# EasyEDA Pro project ProPrj_arm_can_tool_2026-04-18.epro, schematic Schematic1, sheets 1 to 2 of 3

## Sheets
1 P1: Board Name: Board1; Create Date: 2026-01-16; Page Name: P1; Project Name: arm_can_tool; Schematic Name: Schematic1; Update Date: 2026-04-10; Company: CC0 PUBLIC DOMAIN; Drawed: koendv; Page Size: A3; Part Number: JLCPCB-002; Version: 1.0
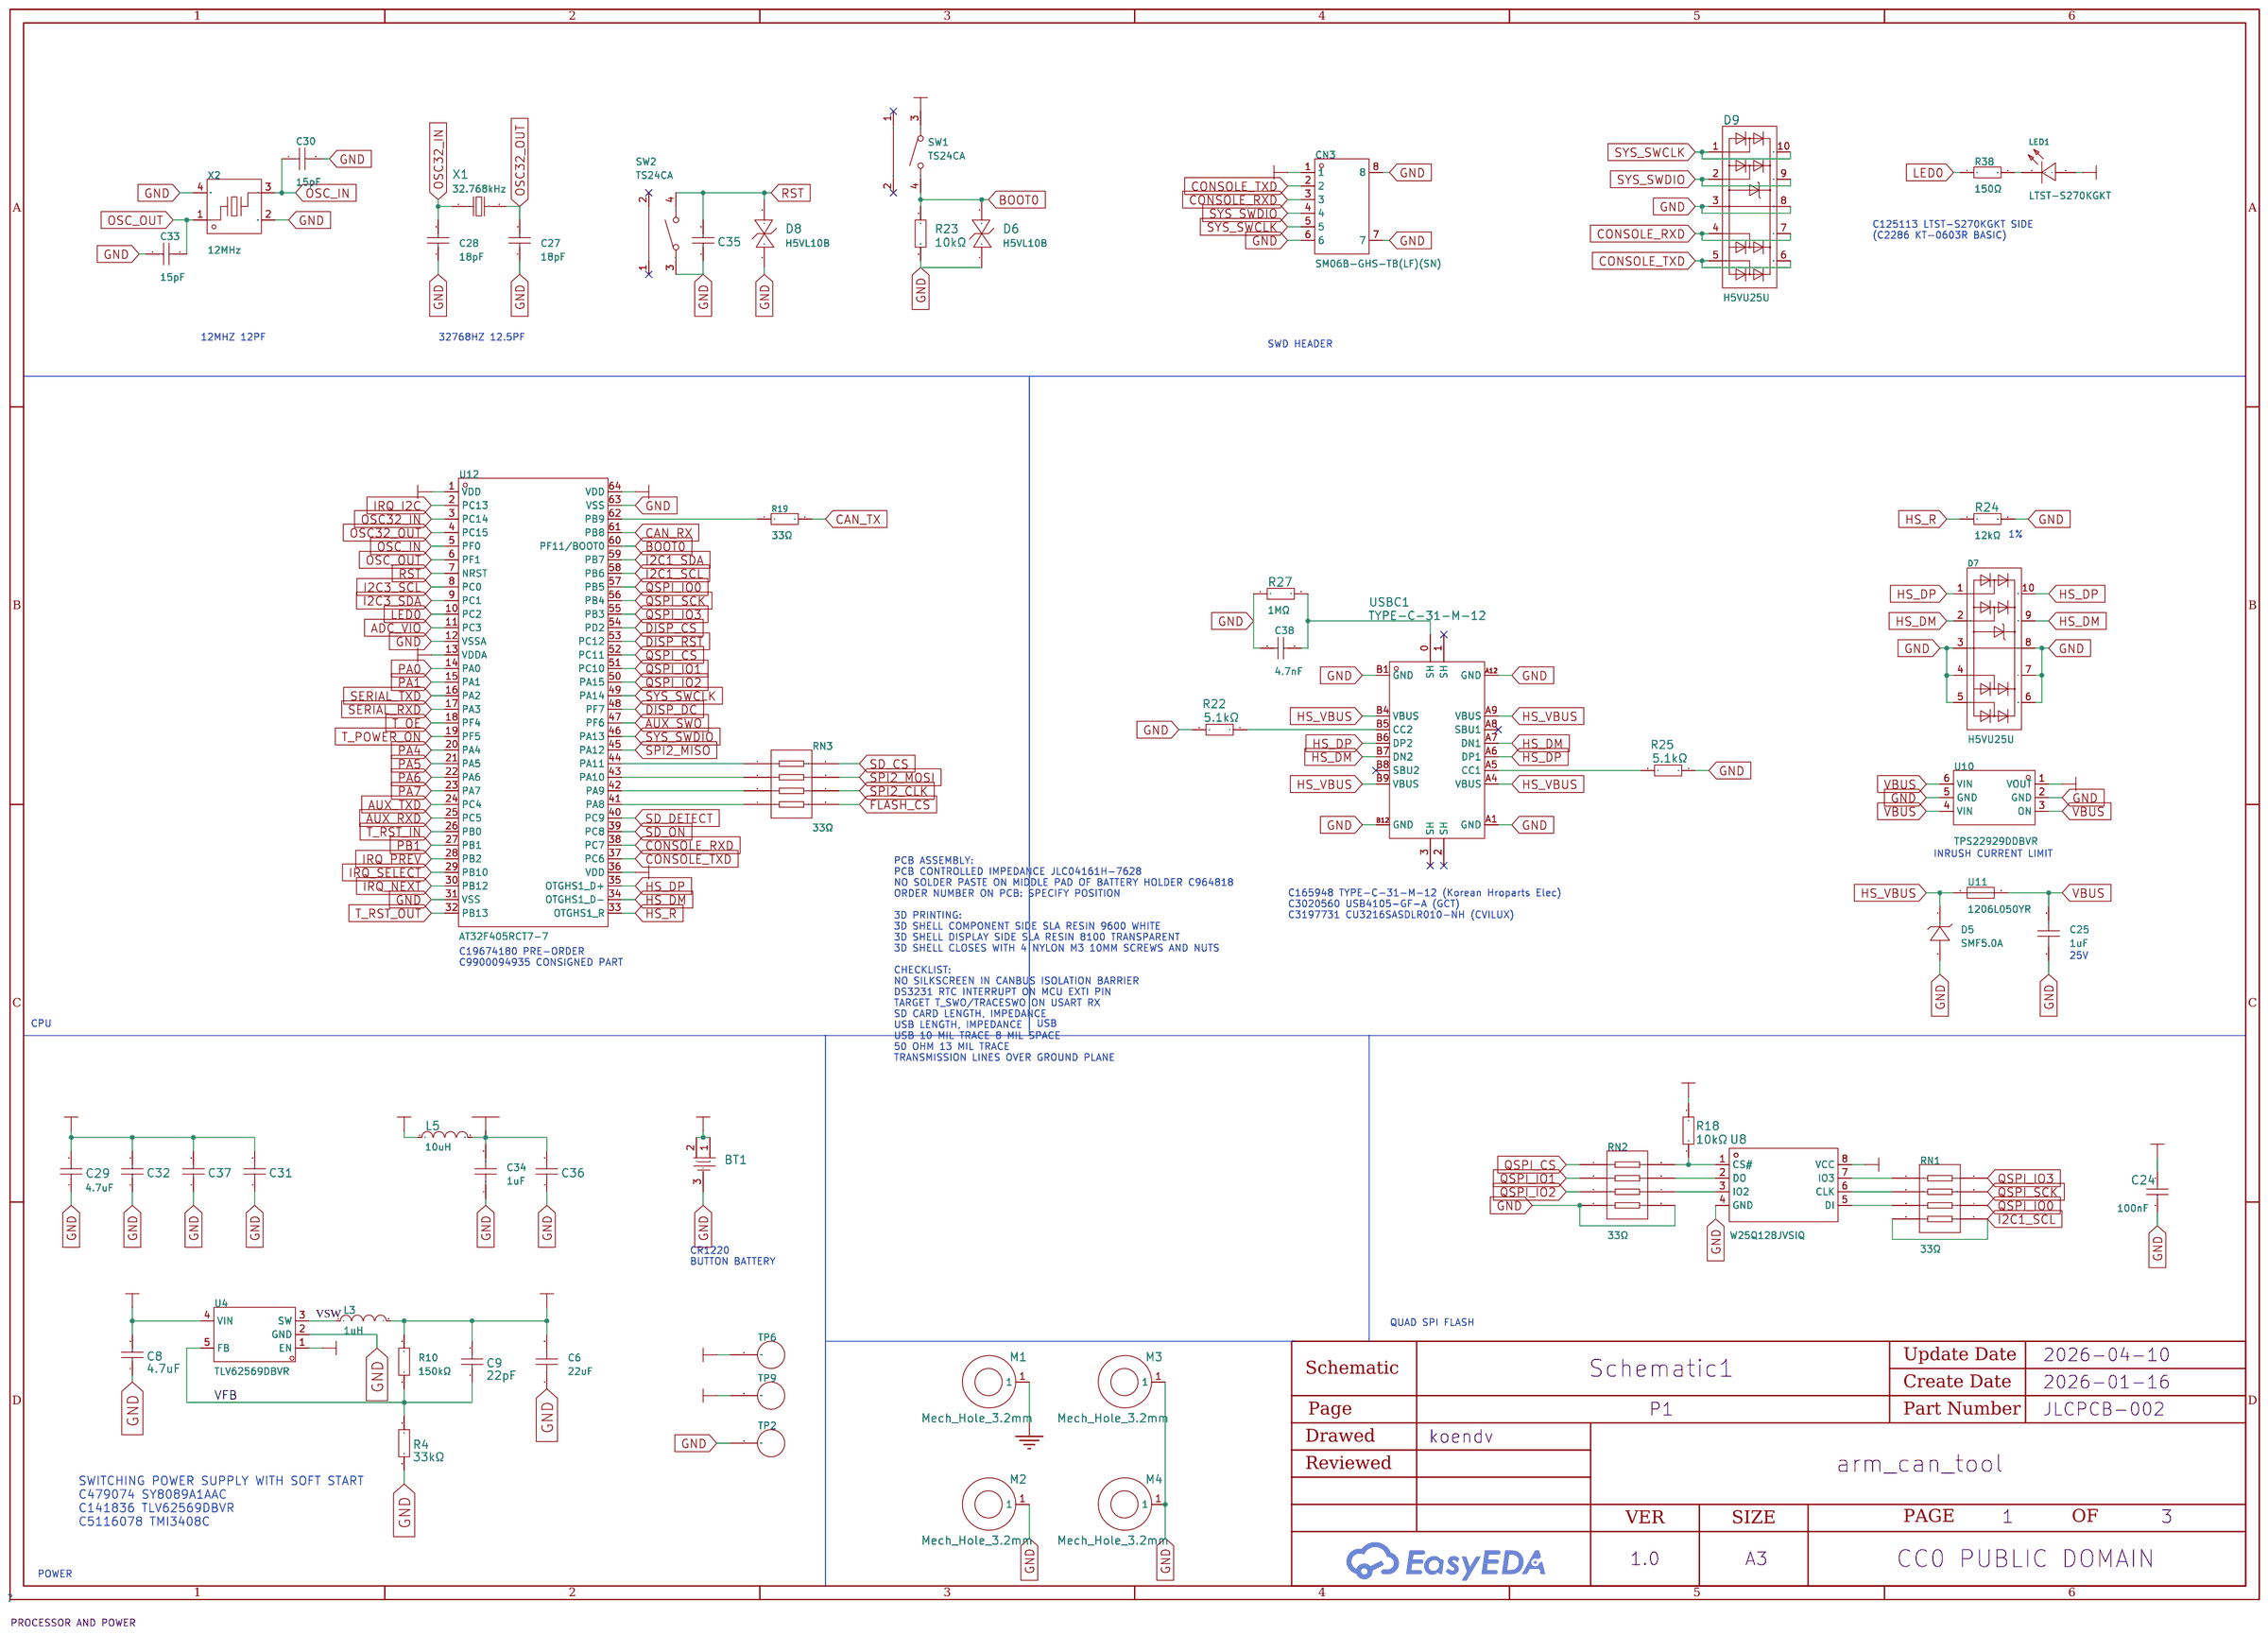
[diagram p0: P1]
2 P2: Page Name: P2; Update Date: 2026-04-11
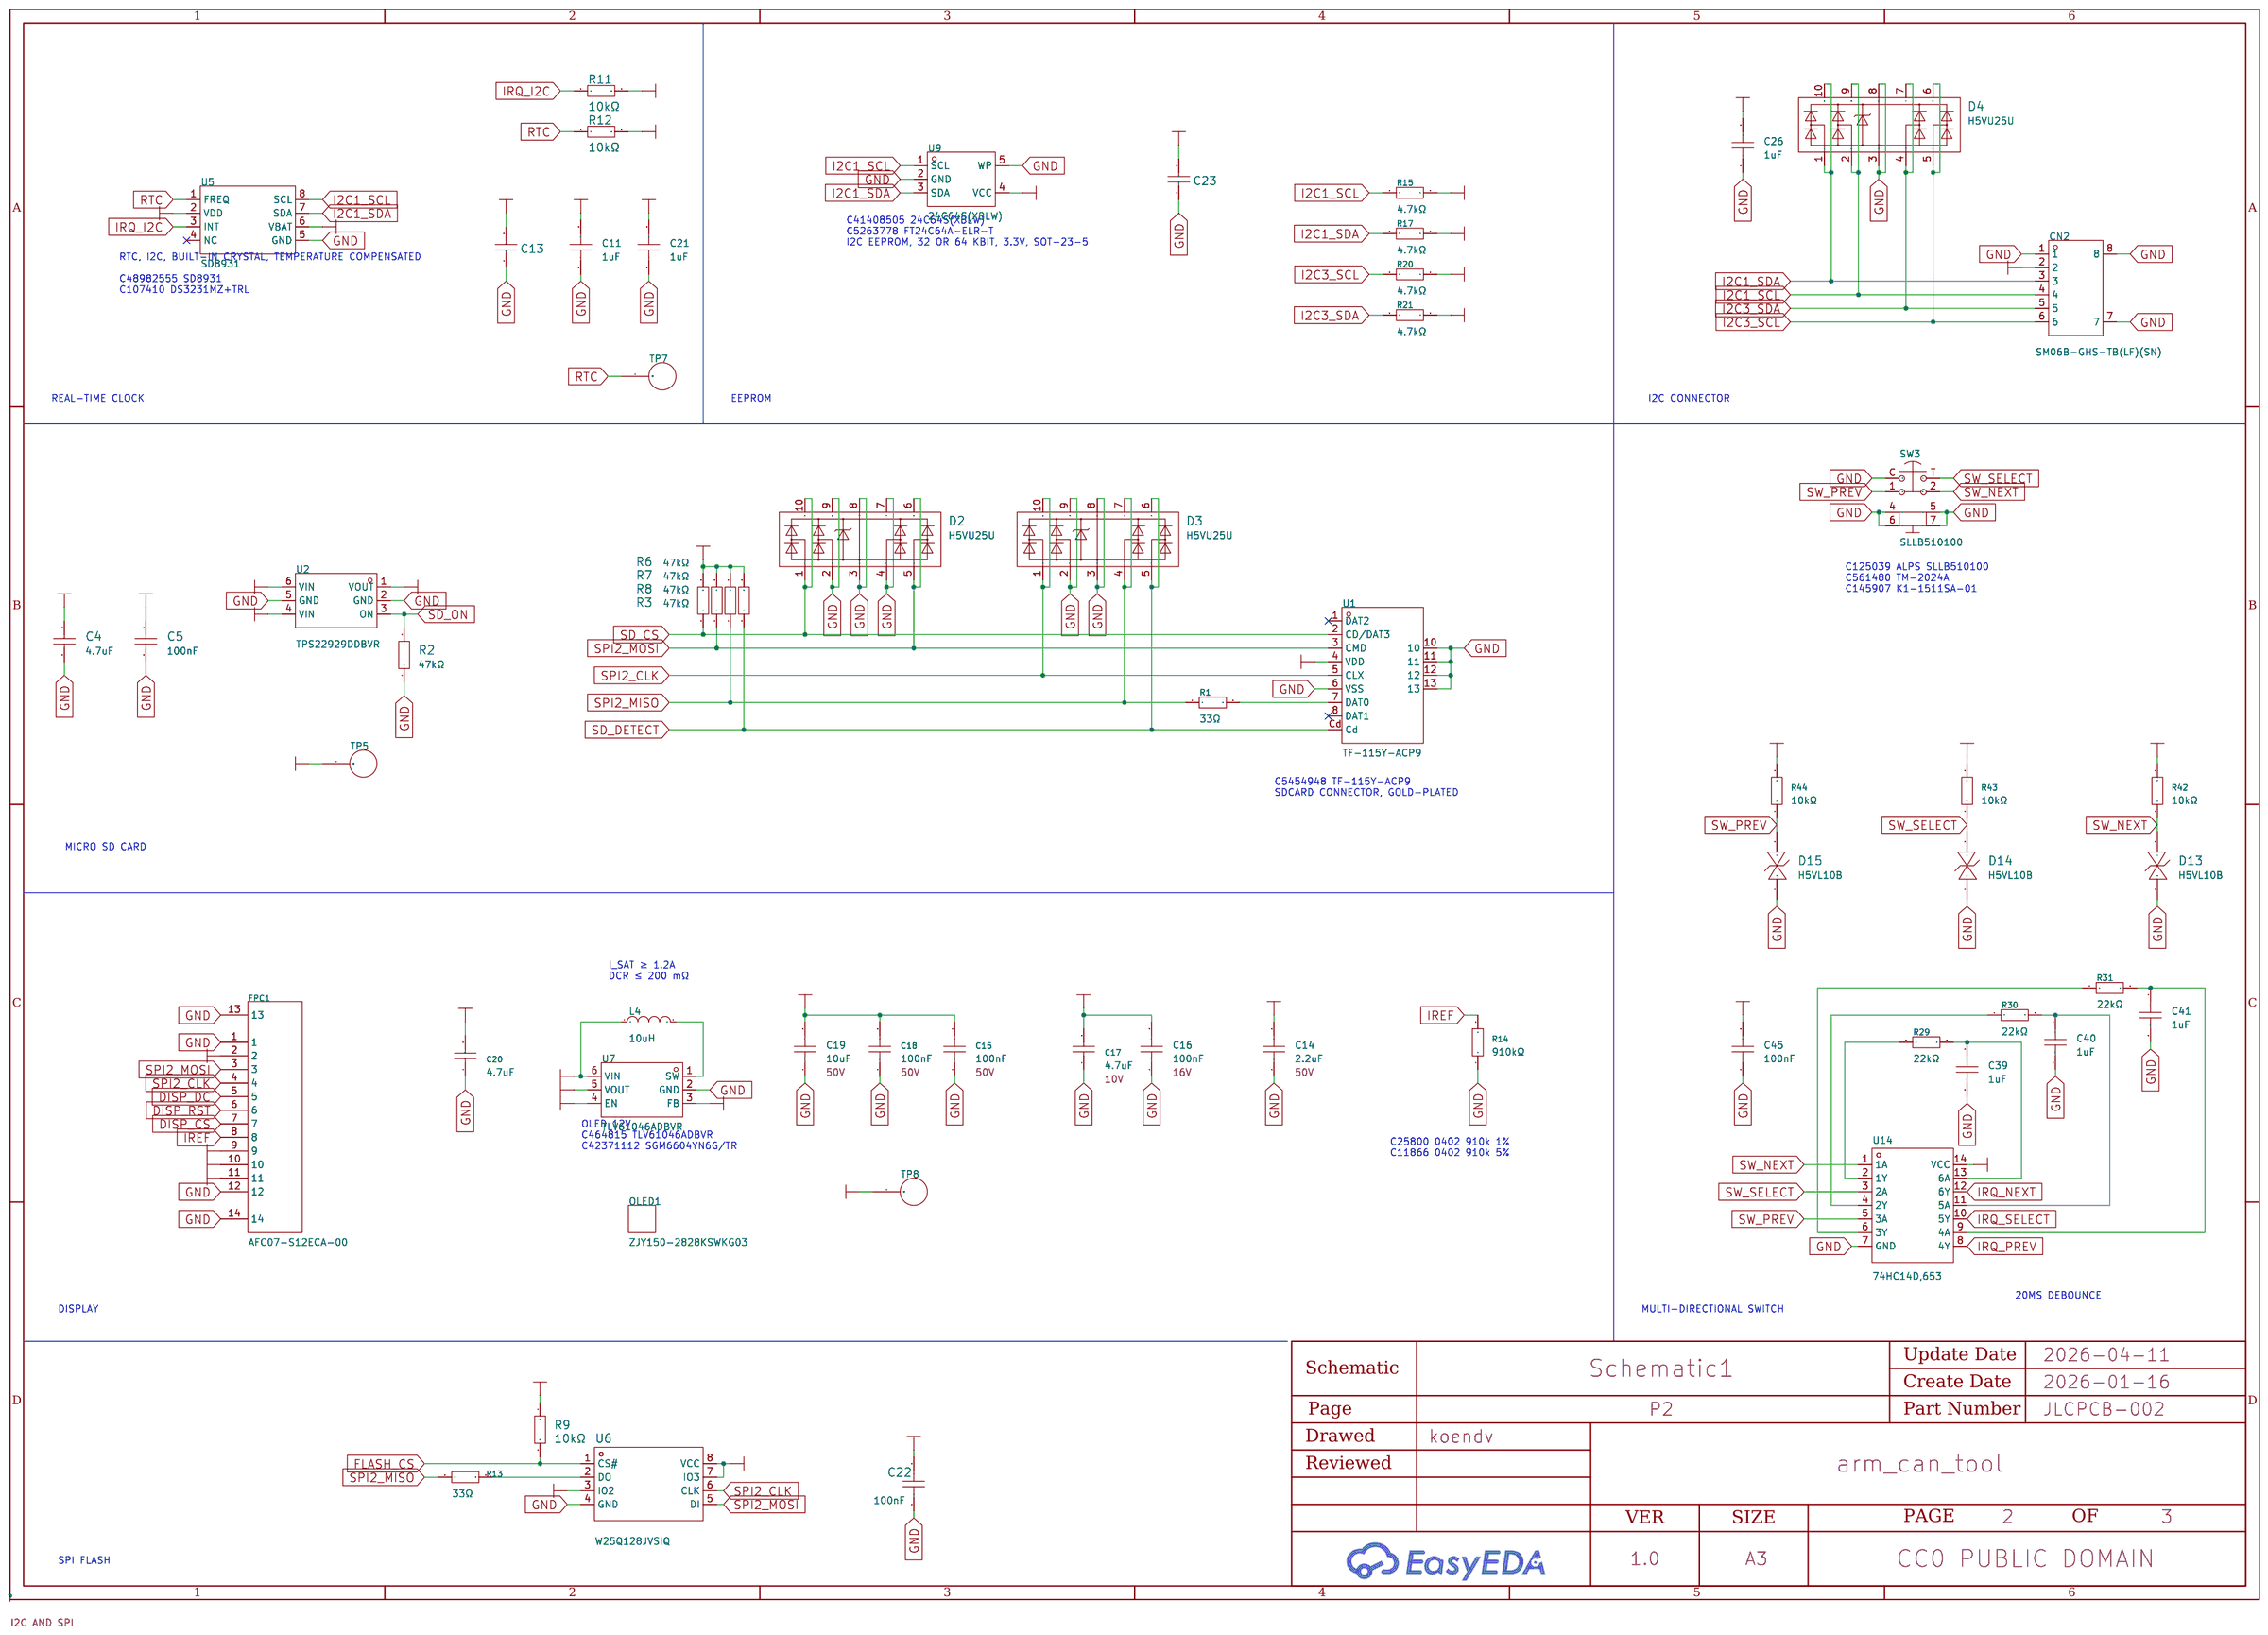
[diagram p1: P2]

## Parts
sheet P1
BT1  MY-1220-03  [BAT-SMD_MY-1220-03]
C6  22uF  [C0603]
C8  4.7uF  [C0603]
C9  22pF  [C0402]
C24  100nF  [C0402]
C25  1uF  [C0402]
C27  18pF  [C0402]
C28  18pF  [C0402]
C29  4.7uF  [C0402]
C30  15pF  [C0402]
C31  100nF  [C0402]
C32  100nF  [C0402]
C33  15pF  [C0402]
C34  1uF  [C0402]
C35  100nF  [C0402]
C36  100nF  [C0402]
C37  100nF  [C0402]
C38  4.7nF  [C0402]
CN3  SM06B-GHS-TB(LF)(SN)  [CONN-TH_SM06B-GHS-TB-LF-SN]
D5  SMF5.0A  [SOD-123FL_L2.7-W1.8-LS3.8-RD]
D6  H5VL10B  [SOD-882_L1.0-W0.6-BI]
D7  H5VU25U  [DFN2510-10_L2.5-W1.0-P0.50-BL]
D8  H5VL10B  [SOD-882_L1.0-W0.6-BI]
D9  H5VU25U  [DFN2510-10_L2.5-W1.0-P0.50-BL]
L3  1uH  [IND-SMD_L2.5-W2.0-A]
L5  10uH  [L0603]
LED1  LTST-S270KGKT  [LED-SMD_L1.7-W0.6-RD]
M1  Mech_Hole_3.2mm  [MECH_HOLE_3.2MM]  (no BOM)
M2  Mech_Hole_3.2mm  [MECH_HOLE_3.2MM]  (no BOM)
M3  Mech_Hole_3.2mm  [MECH_HOLE_3.2MM]  (no BOM)
M4  Mech_Hole_3.2mm  [MECH_HOLE_3.2MM]  (no BOM)
R4  33kΩ  [R0402]
R10  150kΩ  [R0402]
R18  10kΩ  [R0402]
R19  33Ω  [R0402]
R22  5.1kΩ  [R0402]
R23  10kΩ  [R0402]
R24  12kΩ  [R0402]
R25  5.1kΩ  [R0402]
R27  1MΩ  [R0402]
R38  150Ω  [R0402]
RN1  33Ω  [RES-ARRAY-SMD_0402-8P-L2.0-W1.0-BL]
RN2  33Ω  [RES-ARRAY-SMD_0402-8P-L2.0-W1.0-BL]
RN3  33Ω  [RES-ARRAY-SMD_0402-8P-L2.0-W1.0-BL]
SW1  TS24CA  [SW-SMD_TS24CA]
SW2  TS24CA  [SW-SMD_TS24CA]
TP2  -  [TEST PAD]  (no BOM)
TP6  -  [TEST PAD]  (no BOM)
TP9  -  [TEST PAD]  (no BOM)
U4  TLV62569DBVR  [SOT-23-5_L3.0-W1.7-P0.95-LS2.8-BR]
U8  W25Q128JVSIQ  [SOIC-8_L5.3-W5.3-P1.27-LS8.0-BL]
U10  TPS22929DDBVR  [SOT-23-6_L2.9-W1.6-P0.95-LS2.8-BL]
U11  1206L050YR  [F1206]
U12  AT32F405RCT7-7  [LQFP-64_L7.0-W7.0-P0.40-LS9.0-TL]
USBC1  TYPE-C-31-M-12  [USB-C_SMD-TYPE-C-31-M-12]
X1  32.768kHz  [FC-135R_L3.2-W1.5]
X2  12MHz  [CRYSTAL-SMD_4P-L3.2-W2.5-BL]
sheet P2
C4  4.7uF  [C0603]
C5  100nF  [C0402]
C11  1uF  [C0402]
C13  100nF  [C0402]
C14  2.2uF  [C0805]
C15  100nF  [C0603]
C16  100nF  [C0402]
C17  4.7uF  [C0402]
C18  100nF  [C0603]
C19  10uF  [C0805]
C20  4.7uF  [C0402]
C21  1uF  [C0402]
C22  100nF  [C0402]
C23  100nF  [C0402]
C26  1uF  [C0402]
C39  1uF  [C0402]
C40  1uF  [C0402]
C41  1uF  [C0402]
C45  100nF  [C0402]
CN2  SM06B-GHS-TB(LF)(SN)  [CONN-TH_SM06B-GHS-TB-LF-SN]
D2  H5VU25U  [DFN2510-10_L2.5-W1.0-P0.50-BL]
D3  H5VU25U  [DFN2510-10_L2.5-W1.0-P0.50-BL]
D4  H5VU25U  [DFN2510-10_L2.5-W1.0-P0.50-BL]
D13  H5VL10B  [SOD-882_L1.0-W0.6-BI]
D14  H5VL10B  [SOD-882_L1.0-W0.6-BI]
D15  H5VL10B  [SOD-882_L1.0-W0.6-BI]
FPC1  AFC07-S12ECA-00  [FPC-SMD_12P-P0.50_AFC07-S12ECA-00]
L4  10uH  [IND-SMD_L4.1-W4.1_FTC404020S]
OLED1  ZJY150-2828KSWKG03  [OLED-ZJY150-2828KSWKG03]
R1  33Ω  [R0402]
R2  47kΩ  [R0402]
R3  47kΩ  [R0402]
R6  47kΩ  [R0402]
R7  47kΩ  [R0402]
R8  47kΩ  [R0402]
R9  10kΩ  [R0402]
R11  10kΩ  [R0402]
R12  10kΩ  [R0402]
R13  33Ω  [R0402]
R14  910kΩ  [R0402]
R15  4.7kΩ  [R0402]
R17  4.7kΩ  [R0402]
R20  4.7kΩ  [R0402]
R21  4.7kΩ  [R0402]
R29  22kΩ  [R0402]
R30  22kΩ  [R0402]
R31  22kΩ  [R0402]
R42  10kΩ  [R0402]
R43  10kΩ  [R0402]
R44  10kΩ  [R0402]
SW3  SLLB510100  [SW-SMD_SLLB510100]
TP5  -  [TEST PAD]  (no BOM)
TP7  -  [TEST PAD]  (no BOM)
TP8  -  [TEST PAD]  (no BOM)
U1  TF-115Y-ACP9  [SIM-SMD_TF-115Y-BCP9]
U2  TPS22929DDBVR  [SOT-23-6_L2.9-W1.6-P0.95-LS2.8-BL]
U5  SD8931  [SOP-8_L4.9-W3.9-P1.27-LS6.0-BL-1]
U6  W25Q128JVSIQ  [SOIC-8_L5.3-W5.3-P1.27-LS8.0-BL]
U7  TLV61046ADBVR  [SOT-23-6_L2.9-W1.6-P0.95-LS2.8-BL]
U9  24C64S(XBLW)  [SOT-23-5_L2.9-W1.6-P0.95-LS2.8-BR]
U14  74HC14D,653  [SOIC-14_L8.7-W3.9-P1.27-LS6.0-BL]

## Library data of the parts
BT1 = MY-1220-03: Connector Type:Battery button Battery Type:CR1220 Operating Temperature Range:-25℃~+85℃ Operating Temperature Range:-25℃~+85℃; Supplier Part: C964818; Manufacturer: MYOUNG(美阳); Supplier Footprint: SMD; JLCPCB Part Class: Extended Part; Datasheet: https://atta.szlcsc.com/upload/public/pdf/source/20201218/C964818_B03812FB908E34364C1125E65C8EBE5C.pdf; Supplier: LCSC; Connector Type: Battery button; Battery Type: CR1220; Operating Temperature Range: -25℃~+85℃; Check: false
C6 = CL10A226MQ8NRNC: Capacitance: Tolerance:±20% Tolerance:±20% Voltage Rated: Temperature Coefficient:; LCSC Part Name: 22uF ±20% 6.3V; Supplier Part: C59461; Manufacturer: SAMSUNG(三星); Supplier Footprint: 0603; JLCPCB Part Class: Basic Part; Datasheet: https://atta.szlcsc.com/upload/public/pdf/source/20160218/1457707763339.pdf; Supplier: LCSC; Tolerance: ±20%; Check: false
C4 C8 = CL10A475KO8NNNC: Capacitance:4.7uF Tolerance:±10% Tolerance:±10% Voltage Rating:16V Temperature Coefficient:X5R; LCSC Part Name: 4.7uF ±10% 16V; Supplier Part: C19666; Manufacturer: SAMSUNG(三星); Supplier Footprint: 0603; JLCPCB Part Class: Basic Part; Datasheet: https://item.szlcsc.com/datasheet/CL10A475KO8NNNC/20375.html; Supplier: LCSC; Tolerance: ±10%; Temperature Coefficient: X5R; Voltage Rating: 16V; Check: false
C9 = 0402CG220J500NT: Supplier: LCSC; Manufacturer: FH(风华); Supplier Part: C1555; JLCPCB Part Class: Basic Part; Check: false; LCSC Part Name: 50V 22pF C0G ±5%
C5 C24 C45 = CL05B104KO5NNNC: Capacitance: Tolerance:±10% Tolerance:±10% Voltage Rated: Temperature Coefficient:; LCSC Part Name: 100nF ±10% 16V; Supplier Part: C1525; Manufacturer: SAMSUNG(三星); Supplier Footprint: 0402; JLCPCB Part Class: Basic Part; Datasheet: https://atta.szlcsc.com/upload/public/pdf/source/20160218/1457707763339.pdf; Supplier: LCSC; Tolerance: ±10%; Check: false
C11 C21 C25 C26 C34 C39-C41 = CL05A105KA5NQNC: Capacitance: Tolerance:±10% Tolerance:±10% Voltage Rated: Temperature Coefficient:; LCSC Part Name: 1uF ±10% 25V; Supplier Part: C52923; Manufacturer: SAMSUNG(三星); Supplier Footprint: 0402; JLCPCB Part Class: Basic Part; Datasheet: https://atta.szlcsc.com/upload/public/pdf/source/20160218/1457707763339.pdf; Supplier: LCSC; Tolerance: ±10%; Check: false
C27 C28 = 0402CG180J500NT: Capacitance: Tolerance:±5% Tolerance:±5% Voltage Rated: Temperature Coefficient:; LCSC Part Name: 18pF ±5% 50V; Supplier Part: C1549; Manufacturer: FH(风华); Supplier Footprint: 0402; JLCPCB Part Class: Basic Part; Datasheet: https://atta.szlcsc.com/upload/public/pdf/source/20200305/C486355_26A10D38EF8C2A5C37091D0039909270.pdf; Supplier: LCSC; Tolerance: ±5%; Check: false
C20 C29 = CL05A475MP5NRNC: Capacitance: Tolerance:±20% Tolerance:±20% Voltage Rated: Temperature Coefficient:; LCSC Part Name: 4.7uF ±20% 10V; Supplier Part: C23733; Manufacturer: SAMSUNG(三星); Supplier Footprint: 0402; JLCPCB Part Class: Basic Part; Datasheet: https://atta.szlcsc.com/upload/public/pdf/source/20160218/1457707763339.pdf; Supplier: LCSC; Tolerance: ±20%; Check: false
C30 C33 = 0402CG150J500NT: Capacitance: Tolerance:±5% Tolerance:±5% Voltage Rated: Temperature Coefficient:; LCSC Part Name: 15pF ±5% 50V; Supplier Part: C1548; Manufacturer: FH(风华); Supplier Footprint: 0402; JLCPCB Part Class: Basic Part; Datasheet: https://atta.szlcsc.com/upload/public/pdf/source/20200305/C486355_26A10D38EF8C2A5C37091D0039909270.pdf; Supplier: LCSC; Tolerance: ±5%; Check: false
C31 C32 C35-C37 = CL05B104KO5NNNC: Capacitance: Tolerance:±10% Tolerance:±10% Voltage Rated: Temperature Coefficient:; LCSC Part Name: 100nF ±10% 16V; Supplier Part: C1525; Manufacturer: SAMSUNG(三星); Supplier Footprint: 0402; JLCPCB Part Class: Basic Part; Datasheet: https://atta.szlcsc.com/upload/public/pdf/source/20160218/1457707763339.pdf; Supplier: LCSC; Tolerance: ±10%; 3DModel: C0402_L1.0-W0.5-H0.5; link: https://item.szlcsc.com/15869.html; Check: false
C38 = 0402B472K500NT: Capacitance:4.7nF Tolerance:±10% Tolerance:±10% Voltage Rated: Temperature Coefficient:; LCSC Part Name: 4.7nF ±10% 50V; Supplier Part: C1538; Manufacturer: FH(风华); Supplier Footprint: 0402; JLCPCB Part Class: Basic Part; Datasheet: https://atta.szlcsc.com/upload/public/pdf/source/20200305/C486355_26A10D38EF8C2A5C37091D0039909270.pdf; Supplier: LCSC; Tolerance: ±10%; Check: false
CN2 CN3 = SM06B-GHS-TB(LF)(SN): Pins Structure:1x6P Pitch:1.25mm Mounting Style:Horizontal attachment Reference Series:GH Number of Pins:6P Number of Rows:1 Number of PINs Per Row:6 Row Spacing:- Current Rating (Max):1A Contact Material:Phosphor Bronze Contact Plating:Tin Operating Temp; LCSC Part Name: 1x6P 间距:1.25mm 卧贴 系列:GH; Supplier Part: C133065; Manufacturer: JST; Supplier Footprint: SMD,P=1.25mm,卧贴; JLCPCB Part Class: Extended Part; Datasheet: https://atta.szlcsc.com/upload/public/pdf/source/20180323/112205B2CF875947C9562BFC7B01FA26.pdf; Supplier: LCSC; Pins Structure: 1x6P; Pitch: 1.25mm; Mounting Style: Horizontal attachment; Reference Series: GH; Number of Pins: 6P; Number of Rows: 1; Number of PINs Per Row: 6; Current Rating (Max): 1A; Contact Material: Phosphor Bronze; Contact Plating: Tin; Operating Temperature Range: -25℃~+85℃; Rated Voltage (Max): 50V; Plastic Material: PA9T; Flame Retardant Rating: UL94V-0; Supplementary Features: Auxiliary soldering legs; Colour: White; Z-Height of the Board: 4.25mm; X-Length of Bottom Edge on Board (Spacing Line): 10.75mm; Y-Width of Bottom Edge on Board: 4.13mm; Check: false
D5 = SMF5.0A_C19077497: Polarity:Unidirectional Reverse Stand-Off Voltage (Vrwm):5V Clamping Voltage:9.2V Peak Pulse Current (Ipp):21.7A@10/1000us Peak Pulse Power Dissipation (Ppp):200W@10/1000us Voltage - Breakdown:7V Reverse Leakage Current (Ir):400uA Number of Channels:1 Ope; LCSC Part Name: 单向TVS 5V截止 峰值浪涌电流：21.7A@10/1000us; Supplier Part: C19077497; Manufacturer: R+O(宏嘉诚); Supplier Footprint: SOD-123FL; JLCPCB Part Class: Extended Part; Datasheet: https://item.szlcsc.com/datasheet/SMF5.0A/20275582.html; Supplier: LCSC; Polarity: Unidirectional; Reverse Stand-Off Voltage (Vrwm): 5V; Clamping Voltage: 9.2V; Peak Pulse Current (Ipp): 21.7A@10/1000us; Peak Pulse Power Dissipation (Ppp): 200W@10/1000us; Voltage - Breakdown: 7V; Reverse Leakage Current (Ir): 400uA; Number of Channels: 1; Operating Temperature: -55℃~+150℃; level of protection: IEC 61000-4-2; Type: TVS; Check: false
D6 D8 D13-D15 = H5VL10B: polarity:Bi-Directional Reverse Stand-Off Voltage (Vrwm):5V Maximum Clamping Voltage:10V Peak Pulse Current (Ipp)@10/1000us:5A Peak Pulse Power Dissipation (Ppp)@10/1000us:50W Breakdown Voltage:5.6V Reverse Leakage Current (Ir):100nA Number of Lines:单路 Op; Supplier Part: C7420372; Manufacturer: 宏迦橙; Supplier Footprint: DFN1006-2L; JLCPCB Part Class: Extended Part; Datasheet: https://atta.szlcsc.com/upload/public/pdf/source/20230630/5024ECFEAD3C9801B07A8DBB967AB462.pdf; Supplier: LCSC; polarity: Bi-Directional; Reverse Stand-Off Voltage (Vrwm): 5V; Maximum Clamping Voltage: 10V; Peak Pulse Current (Ipp)@10/1000us: 5A; Peak Pulse Power Dissipation (Ppp)@10/1000us: 50W; Breakdown Voltage: 5.6V; Reverse Leakage Current (Ir): 100nA; Number of Lines: 单路; Operating Temperature: -55℃~+155℃; Type: TVS; Check: false
D2-D4 D7 D9 = H5VU25U: polarity:Unidirectional Reverse Stand-Off Voltage (Vrwm):5V Maximum Clamping Voltage:14V Peak Pulse Current (Ipp)@10/1000us:4A Peak Pulse Power Dissipation (Ppp)@10/1000us:56W Breakdown Voltage:6V Reverse Leakage Current (Ir):1uA Number of Lines:Quad Oper; Supplier Part: C7420374; Manufacturer: 宏迦橙; Supplier Footprint: DFN2510-10L; JLCPCB Part Class: Extended Part; Datasheet: https://atta.szlcsc.com/upload/public/pdf/source/20230630/91FD1DB17AB88B6832D3039FAE61FF10.pdf; Supplier: LCSC; polarity: Unidirectional; Reverse Stand-Off Voltage (Vrwm): 5V; Maximum Clamping Voltage: 14V; Peak Pulse Current (Ipp)@10/1000us: 4A; Peak Pulse Power Dissipation (Ppp)@10/1000us: 56W; Breakdown Voltage: 6V; Reverse Leakage Current (Ir): 1uA; Number of Lines: Quad; Operating Temperature: -55℃~+155℃; Type: TVS; Check: false
L3 = TFM252012ALM-1R0MTAA: Inductance: Tolerance:±20% Tolerance:±20% Rated Current:- DC Resistance (DCR):-; LCSC Part Name: 1uH ±20%; Supplier Part: C433057; Manufacturer: TDK; Supplier Footprint: SMD; JLCPCB Part Class: Extended Part; Supplier: LCSC; Tolerance: ±20%; Check: false
L5 = SDFL1608S100KTF: Inductance: Tolerance: Tolerance: Rated Current: Saturation Current (Isat):- DC Resistance (DCR): Q @ Freq:30@2MHz Frequency - Self Resonant: Ratings:; LCSC Part Name: 10uH ±10% 3mA 1.85Ω; Supplier Part: C1035; Manufacturer: Sunlord(顺络); Supplier Footprint: 0603; JLCPCB Part Class: Basic Part; Supplier: LCSC; Q @ Freq: 30@2MHz; Check: false
LED1 = LTST-S270KGKT: Emitted Color:Green-yellow Power Dissipation:75mW Forward Current:20mA Dominant Wavelength:571nm Dominant Wavelength:571nm Peak Wavelength:574nm Diode Configuration:- Lens Color:无色透明透镜 Color Temperature:- Color Temperature:- Viewing Angle:130° Mounting Sy; LCSC Part Name: 普绿/黄绿 侧贴; Supplier Part: C125113; Manufacturer: LITEON(光宝); Supplier Footprint: SMD,1.2x1.6mm; JLCPCB Part Class: Extended Part; Datasheet: https://atta.szlcsc.com/upload/public/pdf/source/20180104/C125113_15150602232371230485.pdf; Supplier: LCSC; Emitted Color: Green-yellow; Power Dissipation: 75mW; Forward Current: 20mA; Dominant Wavelength: 571nm; Peak Wavelength: 574nm; Lens Color: 无色透明透镜; Viewing Angle: 130°; Mounting Sytle: Side stickers; Operating Temperature: -30℃~+85℃; Check: false
M1-M4 = Mech_Hole_3.2mm: Check: false; Height: 0.001mm
R4 = 0402WGF3302TCE: Supplier: LCSC; Manufacturer: UNI-ROYAL(厚声); Supplier Part: C25779; Resistance: 33K; JLCPCB Part Class: Basic Part; Check: false; LCSC Part Name: 33kΩ ±1% 62.5mW 厚膜电阻
R10 = 0402WGF1503TCE: Type:Thick Film Resistors Resistance:150kΩ Tolerance:±1% Tolerance:±1% Power(Watts): Overload Voltage (Max): Temperature Coefficient:±100ppm/℃ Temperature Coefficient:±100ppm/℃ Operating Temperature Range:-55℃~+155℃ Operating Temperature Range:-55℃~+155℃; LCSC Part Name: 150kΩ ±1% 62.5mW 厚膜电阻; Supplier Part: C25755; Manufacturer: UNI-ROYAL(厚声); Supplier Footprint: 0402; JLCPCB Part Class: Extended Part; Datasheet: https://atta.szlcsc.com/upload/public/pdf/source/20200306/C422600_1E6D84923E4A46A82E41ADD87F860B5C.pdf; Supplier: LCSC; Type: Thick Film Resistors; Tolerance: ±1%; Temperature Coefficient: ±100ppm/℃; Operating Temperature Range: -55℃~+155℃; Check: false
R9 R11 R12 R18 R23 = 0402WGF1002TCE: Type:Thick Film Resistor Resistance:10kΩ Tolerance:±1% Tolerance:±1% Power(Watts):62.5mW Voltage-Supply(Max):50V Temperature Coefficient:±100ppm/℃ Temperature Coefficient:±100ppm/℃ Operating Temperature:-55℃~+155℃ Operating Temperature:-55℃~+155℃; LCSC Part Name: 10kΩ ±1% 62.5mW 厚膜电阻; Supplier Part: C25744; Manufacturer: UNI-ROYAL(厚声); Supplier Footprint: 0402; JLCPCB Part Class: Basic Part; Datasheet: https://atta.szlcsc.com/upload/public/pdf/source/20200306/C422600_1E6D84923E4A46A82E41ADD87F860B5C.pdf; Supplier: LCSC; Tolerance: ±1%; Power(Watts): 62.5mW; Temperature Coefficient: ±100ppm/℃; Type: Thick Film Resistors; Operating Temperature Range: -55℃~+155℃; Voltage-Supply(Max): 50V; Operating Temperature: -55℃~+155℃; Check: false
R1 R13 R19 = 0402WGF330JTCE: Type:Thick Film Resistors Resistance:33Ω Tolerance:±1% Tolerance:±1% Power(Watts): Overload Voltage (Max): Temperature Coefficient:±100ppm/℃ Temperature Coefficient:±100ppm/℃ Operating Temperature Range:-55℃~+155℃ Operating Temperature Range:-55℃~+155℃; LCSC Part Name: 33Ω ±1% 62.5mW 厚膜电阻; Supplier Part: C25105; Manufacturer: UNI-ROYAL(厚声); Supplier Footprint: 0402; JLCPCB Part Class: Basic Part; Datasheet: https://atta.szlcsc.com/upload/public/pdf/source/20200306/C422600_1E6D84923E4A46A82E41ADD87F860B5C.pdf; Supplier: LCSC; Type: Thick Film Resistors; Tolerance: ±1%; Temperature Coefficient: ±100ppm/℃; Operating Temperature Range: -55℃~+155℃; Check: false
R22 R25 = 5.1kΩ: link: https://item.szlcsc.com/323315.html; 3DModel: R0402_L1.0-W0.5-H0.5; Supplier: LCSC; Manufacturer: UNI-ROYAL(厚声); Manufacturer Part: 0402WGF5101TCE; Supplier Part: C25905; Resistance: 5.1K; JLCPCB Part Class: BasicPart; Check: false
R24 = 0402WGF1202TCE: Type:Thick Film Resistors Resistance:12kΩ Tolerance:±1% Tolerance:±1% Power(Watts): Overload Voltage (Max): Temperature Coefficient:±100ppm/℃ Temperature Coefficient:±100ppm/℃ Operating Temperature Range:-55℃~+155℃ Operating Temperature Range:-55℃~+155℃; LCSC Part Name: 12kΩ ±1% 62.5mW 厚膜电阻; Supplier Part: C25752; Manufacturer: UNI-ROYAL(厚声); Supplier Footprint: 0402; JLCPCB Part Class: Basic Part; Datasheet: https://atta.szlcsc.com/upload/public/pdf/source/20200306/C422600_1E6D84923E4A46A82E41ADD87F860B5C.pdf; Supplier: LCSC; Type: Thick Film Resistors; Tolerance: ±1%; Temperature Coefficient: ±100ppm/℃; Operating Temperature Range: -55℃~+155℃; Check: false
R27 = 0402WGF1004TCE: Resistance:1000000Ω Tolerance:±1% Tolerance:±1% Power(Watts): Overload Voltage (Max): Temperature Coefficient:±100ppm/℃ Temperature Coefficient:±100ppm/℃ Type:Thick Film Resistors Operating Temperature Range:-55℃~+155℃ Operating Temperature Range:-55℃~+15; LCSC Part Name: 1MΩ ±1% 62.5mW 厚膜电阻; Supplier Part: C26083; Manufacturer: UNI-ROYAL(厚声); Supplier Footprint: 0402; JLCPCB Part Class: Basic Part; Datasheet: https://atta.szlcsc.com/upload/public/pdf/source/20200306/C422600_1E6D84923E4A46A82E41ADD87F860B5C.pdf; Supplier: LCSC; Tolerance: ±1%; Temperature Coefficient: ±100ppm/℃; Type: Thick Film Resistors; Operating Temperature Range: -55℃~+155℃; Check: false
R38 = 0402WGF1500TCE: Type:Thick Film Resistors Resistance: Tolerance:±1% Tolerance:±1% Power(Watts): Overload Voltage (Max): Temperature Coefficient:±100ppm/℃ Temperature Coefficient:±100ppm/℃ Operating Temperature Range:-55℃~+155℃ Operating Temperature Range:-55℃~+155℃; LCSC Part Name: 150Ω ±1% 62.5mW 厚膜电阻; Supplier Part: C25082; Manufacturer: UNI-ROYAL(厚声); Supplier Footprint: 0402; JLCPCB Part Class: Extended Part; Datasheet: https://atta.szlcsc.com/upload/public/pdf/source/20200306/C422600_1E6D84923E4A46A82E41ADD87F860B5C.pdf; Supplier: LCSC; Type: Thick Film Resistors; Tolerance: ±1%; Temperature Coefficient: ±100ppm/℃; Operating Temperature Range: -55℃~+155℃; Check: false
RN1-RN3 = YC124-FR-0733RL: Number of Resistors: Resistance: Tolerance:±1% Tolerance:±1% Power(Watts): Temperature Coefficient:±200ppm/℃ Temperature Coefficient:±200ppm/℃ Number of Pins:; LCSC Part Name: 33Ω ±1% 0402x4; Supplier Part: C136851; Manufacturer: YAGEO(国巨); Supplier Footprint: 0402x4; JLCPCB Part Class: Extended Part; Datasheet: https://atta.szlcsc.com/upload/public/pdf/source/20180730/C256814_200CCA6CC84D78D7E49AE6680727F338.pdf; Supplier: LCSC; Tolerance: ±1%; Temperature Coefficient: ±200ppm/℃; Check: false
SW1 SW2 = TS24CA: Circuit:SPST Actuator Style:Rectangle button Mounting Style:卧贴 Switch Length:4.55mm Switch Width:1.8mm Switch Height:3.5mm Contact Current:50mA Voltage Rating (DC):12V With Lamp:- Mechanical Life:-; LCSC Part Name: 4.55*1.8*3.5mm 卧贴 轻触开关; Supplier Part: C393942; Manufacturer: SHOU HAN(首韩); Supplier Footprint: SMD; JLCPCB Part Class: Extended Part; Datasheet: https://atta.szlcsc.com/upload/public/pdf/source/20190521/C393942_591A9E318887EFA4274D34029981AD99.pdf; Supplier: LCSC; Circuit: SPST; Actuator Style: Rectangle button; Mounting Style: 卧贴; Switch Length: 4.55mm; Switch Width: 1.8mm; Switch Height: 3.5mm; Contact Current: 50mA; Voltage Rating (DC): 12V; Check: false
TP2 TP5-TP9 = TEST PAD: Check: false
U4 = TLV62569DBVR: Function:Step-down type Synchronous Rectification:Yes Output Type:Adjustable Number of Outputs:- Topology:Step-down Input Voltage:2.5V~5.5V Input Voltage:2.5V~5.5V Output Voltage:0.6V~5.5V Output Voltage:0.6V~5.5V Output Current (Max):2A Switching Frequen; LCSC Part Name: 降压型 输入2.5V~5.5V 输出600mV~5.5V 2A; Supplier Part: C141836; Manufacturer: TI(德州仪器); Supplier Footprint: SOT-23-5; JLCPCB Part Class: Extended Part; Datasheet: https://atta.szlcsc.com/upload/public/pdf/source/20180423/C141836_1FC17A3D2C2E4ECD339DF92B83CED618.pdf; Supplier: LCSC; Function: Step-down type; Synchronous Rectification: Yes; Output Type: Adjustable; Topology: Step-down; Input Voltage: 2.5V~5.5V; Output Voltage: 0.6V~5.5V; Output Current (Max): 2A; Switching Frequency: 1.5MHz; Operating Temperature: -40℃~+125℃@(TJ); Check: false
U8 = W25Q128JVSIQ: Interface Type:- Memory Size:128Mbit Clock Frequency (fc):- Supply Voltage:- Supply Voltage:- Supply Current (Read):- Supply Current (Program):- Supply Current (Erase):- Standby supply current:- Page Programming Time (Tpp):- Block Erase Time (tBE):- Data; LCSC Part Name: W25Q128JVSIQ 编带; Supplier Part: C97521; Manufacturer: WINBOND(华邦); Supplier Footprint: SOP-8-208mil; JLCPCB Part Class: Basic Part; Datasheet: https://atta.szlcsc.com/upload/public/pdf/source/20170316/1489627409956.pdf; Supplier: LCSC; Memory Size: 128Mbit; Check: false
U2 U10 = TPS22929DDBVR: Number of Outputs:1 Output Current:1.8A Input Voltage:1.4V~5.5V Input Voltage:1.4V~5.5V Resistor On-State:115mΩ Operating Temperature-:-40℃~+85℃ Operating Temperature-:-40℃~+85℃; Supplier Part: C415177; Manufacturer: TI(德州仪器); Supplier Footprint: SOT-23-6; JLCPCB Part Class: Extended Part; Datasheet: https://www.ti.com/cn/lit/gpn/tps22929d; Supplier: LCSC; Number of Outputs: 1; Output Current: 1.8A; Input Voltage: 1.4V~5.5V; Resistor On-State: 115mΩ; Operating Temperature	-: -40℃~+85℃; Check: false
U11 = 1206L050YR: Voltage - Max:6V Current - Max:100A Hold Current:500mA Trip Current:1A Power Dissipation:600mW Resistance - Initial (Ri) (Min):150mΩ Resistance - Post Trip (R1) (Max):700mΩ Time to Trip(Max):100ms Operating Temperature:-40℃~+85℃ Operating Temperature:-40℃; LCSC Part Name: 6V 500mA 1206自恢复; Supplier Part: C163512; Manufacturer: Littelfuse(美国力特); Supplier Footprint: 1206; JLCPCB Part Class: Extended Part; Datasheet: https://item.szlcsc.com/datasheet/1206L050YR/174894.html; Supplier: LCSC; Voltage - Max: 6V; Current - Max: 100A; Hold Current: 500mA; Trip Current: 1A; Power Dissipation: 600mW; Resistance - Initial (Ri) (Min): 150mΩ; Resistance - Post Trip (R1) (Max): 700mΩ; Time to Trip(Max): 100ms; Operating Temperature: -40℃~+85℃; Check: false
U12 = AT32F405RCT7-7: Supplier Part: C9900094935; Manufacturer: Artery(雅特力); Supplier Footprint: LQFP-64_7X7mm; JLCPCB Part Class: Extended Part; Supplier: LCSC; Check: false; Height: 1.4mm
USBC1 = TYPE-C-31-M-12: link: https://so.szlcsc.com/global.html?c=&amp;k=C165948; Supplier: LCSC; Supplier Part: C165948; Manufacturer: 韩国韩荣; JLCPCB Part Class: ExtendedPart; Check: false
X1 = Q13FC1350000400: Crystal Type:SMD Crystal Resonator Frequency: Load Capacitance: Equivalent Series Resistance (ESR):70kΩ Frequency Tolerance:±20ppm Frequency Tolerance:±20ppm Operating Temperature: Operating Temperature:; LCSC Part Name: 32.768kHz ±20ppm 12.5pF; Supplier Part: C32346; Manufacturer: EPSON(爱普生); Supplier Footprint: SMD3215-2P; JLCPCB Part Class: Basic Part; Datasheet: https://atta.szlcsc.com/upload/public/pdf/source/20190108/C32346_746D6B07EAF90824457A96480007685F.pdf; Supplier: LCSC; Crystal Type: SMD Crystal Resonator; Equivalent Series Resistance (ESR): 70kΩ; Frequency Tolerance: ±20ppm; Check: false
X2 = CJ13-120001210B20: Frequency:12MHz Normal temperature Frequency Tolerance:±10ppm Normal temperature Frequency Tolerance:±10ppm External load capacitor:; LCSC Part Name: 12MHz ±10ppm 12pF; Supplier Part: C2875246; Manufacturer: CJ(江苏长电/长晶); Supplier Footprint: SMD3225-4P; JLCPCB Part Class: Extended Part; Datasheet: https://atta.szlcsc.com/upload/public/pdf/source/20210824/E6873A29EC9F0F4D38BC5C84A85B05C9.pdf; Supplier: LCSC; Normal temperature Frequency Tolerance: ±10ppm; Check: false
C13 C22 C23 = CL05B104KO5NNNC: Capacitance: Tolerance:±10% Tolerance:±10% Voltage Rated: Temperature Coefficient:; LCSC Part Name: 100nF ±10% 16V; Supplier Part: C1525; Manufacturer: SAMSUNG(三星); Supplier Footprint: 0402; JLCPCB Part Class: Basic Part; Datasheet: https://atta.szlcsc.com/upload/public/pdf/source/20160218/1457707763339.pdf; Supplier: LCSC; Tolerance: ±10%; Check: false; Standardization Check: false
C14 = CL21A225KBQNNNE: Capacitance: Tolerance:±10% Tolerance:±10% Voltage Rated: Temperature Coefficient:; LCSC Part Name: 2.2uF ±10% 50V; Supplier Part: C377773; Manufacturer: SAMSUNG(三星); Supplier Footprint: 0805; JLCPCB Part Class: Basic Part; Datasheet: https://atta.szlcsc.com/upload/public/pdf/source/20160218/1457707763339.pdf; Supplier: LCSC; Tolerance: ±10%; Voltage Rated: 50V; Check: false
C15 C18 = CC0603KRX7R9BB104: Capacitance: Tolerance:±10% Tolerance:±10% Voltage Rated: Temperature Coefficient:; LCSC Part Name: 100nF ±10% 50V; Supplier Part: C14663; Manufacturer: YAGEO(国巨); Supplier Footprint: 0603; JLCPCB Part Class: Basic Part; Datasheet: https://atta.szlcsc.com/upload/public/pdf/source/20180910/C282072_33301C7F631E79921B82A8DAC6BCC5B3.pdf; Supplier: LCSC; Tolerance: ±10%; Voltage Rated: 50V; Check: false
C16 = CL05B104KO5NNNC: Capacitance: Tolerance:±10% Tolerance:±10% Voltage Rated: Temperature Coefficient:; LCSC Part Name: 100nF ±10% 16V; Supplier Part: C1525; Manufacturer: SAMSUNG(三星); Supplier Footprint: 0402; JLCPCB Part Class: Basic Part; Datasheet: https://atta.szlcsc.com/upload/public/pdf/source/20160218/1457707763339.pdf; Supplier: LCSC; Tolerance: ±10%; Voltage Rated: 16V; Check: false
C17 = CL05A475MP5NRNC: Capacitance: Tolerance:±20% Tolerance:±20% Voltage Rated: Temperature Coefficient:; LCSC Part Name: 4.7uF ±20% 10V; Supplier Part: C23733; Manufacturer: SAMSUNG(三星); Supplier Footprint: 0402; JLCPCB Part Class: Basic Part; Datasheet: https://atta.szlcsc.com/upload/public/pdf/source/20160218/1457707763339.pdf; Supplier: LCSC; Tolerance: ±20%; Voltage Rated: 10V; Check: false
C19 = GRM21BR61H106KE43L: Capacitance: Tolerance:±10% Tolerance:±10% Voltage Rated: Temperature Coefficient:; LCSC Part Name: 10uF ±10% 50V; Supplier Part: C440198; Manufacturer: muRata(村田); Supplier Footprint: 0805; JLCPCB Part Class: Basic Part; Datasheet: https://atta.szlcsc.com/upload/public/pdf/source/20230811/95AAE0C9AF55EDC31B7A4D8B733F534E.pdf; Supplier: LCSC; Tolerance: ±10%; Voltage Rated: 50V; Check: false
FPC1 = AFC07-S12ECA-00: Locking Feature:抽屉式 Contact Type:Contact,Top Number of Contacts:12P Pitch:0.5mm Mounting Type:卧贴 FFC, FCB Thickness:0.3mm FFC, FCB Thickness:0.3mm Height Above Board:2mm; LCSC Part Name: 间距:0.5mm P数:12P 抽屉式 上接; Supplier Part: C262585; Manufacturer: JS(钜硕电子); Supplier Footprint: SMD,P=0.5mm,卧贴; JLCPCB Part Class: Extended Part; Datasheet: https://atta.szlcsc.com/upload/public/pdf/source/20190726/C11082_A2E7B12387019CE4314BB5199EE0FDF4.pdf; Supplier: LCSC; Locking Feature: 抽屉式; Contact Type: Contact,Top; Number of Contacts: 12P; Pitch: 0.5mm; Mounting Type: 卧贴; FFC, FCB Thickness: 0.3mm; Height Above Board: 2mm; Check: false
L4 = FTC404020S100MGCA: Inductance:10uH Tolerance:±20% Tolerance:±20% Current Rating:3.4A Current - Saturation(Isat):4.9A DC Resistance(DCR):135mΩ Type:-; LCSC Part Name: 10uH ±20% 3.4A; Supplier Part: C39676074; Manufacturer: cjiang(长江微电); Supplier Footprint: SMD,4.1x4.1mm; JLCPCB Part Class: Extended Part; Datasheet: https://item.szlcsc.com/datasheet/FTC404020S100MGCA/41398075.html; Supplier: LCSC; Tolerance: ±20%; Current Rating: 3.4A; Current - Saturation(Isat): 4.9A; DC Resistance(DCR): 135mΩ; Check: false
OLED1 = OLED-ZJY150-2828KSWKG03: OLED 1.5 INCH 128*128 DOTS SH1107 CONTROLLER 插接式; Check: false; Manufacturer: Zhengzhou Zhongjingyuan(中景园); Supplier: taobao; Supplier Part: https://item.taobao.com/item.htm?id=756962244579; Product Link: https://www.alibaba.com/product-detail/1-5-inch-OLED-display-module_1601054555841.html
R2 R3 R6-R8 = 0402WGF4702TCE: Resistance:47000Ω Tolerance:±1% Tolerance:±1% Power(Watts): Overload Voltage (Max): Temperature Coefficient:±100ppm/℃ Temperature Coefficient:±100ppm/℃ Type:Thick Film Resistors Operating Temperature Range:-55℃~+155℃ Operating Temperature Range:-55℃~+155℃; LCSC Part Name: 47kΩ ±1% 62.5mW 厚膜电阻; Supplier Part: C25792; Manufacturer: UNI-ROYAL(厚声); Supplier Footprint: 0402; JLCPCB Part Class: Basic Part; Datasheet: https://atta.szlcsc.com/upload/public/pdf/source/20200306/C422600_1E6D84923E4A46A82E41ADD87F860B5C.pdf; Supplier: LCSC; Tolerance: ±1%; Temperature Coefficient: ±100ppm/℃; Type: Thick Film Resistors; Operating Temperature Range: -55℃~+155℃; Check: false
R14 = 0402WGF9103TCE: Type:Thick Film Resistors Resistance:910kΩ Tolerance:±1% Tolerance:±1% Power(Watts): Overload Voltage (Max): Temperature Coefficient:±100ppm/℃ Temperature Coefficient:±100ppm/℃ Operating Temperature Range:-55℃~+155℃ Operating Temperature Range:-55℃~+155℃; LCSC Part Name: 910kΩ ±1% 62.5mW 厚膜电阻; Supplier Part: C25800; Manufacturer: UNI-ROYAL(厚声); Supplier Footprint: 0402; JLCPCB Part Class: Extended Part; Datasheet: https://atta.szlcsc.com/upload/public/pdf/source/20200306/C422600_1E6D84923E4A46A82E41ADD87F860B5C.pdf; Supplier: LCSC; Type: Thick Film Resistors; Tolerance: ±1%; Temperature Coefficient: ±100ppm/℃; Operating Temperature Range: -55℃~+155℃; Check: false
R15 R17 R20 R21 = 0402WGF4701TCE: Resistance:4700Ω Tolerance:±1% Tolerance:±1% Power(Watts): Overload Voltage (Max): Temperature Coefficient:±100ppm/℃ Temperature Coefficient:±100ppm/℃ Type:Thick Film Resistors Operating Temperature Range:-55℃~+155℃ Operating Temperature Range:-55℃~+155℃; LCSC Part Name: 4.7kΩ ±1% 62.5mW 厚膜电阻; Supplier Part: C25900; Manufacturer: UNI-ROYAL(厚声); Supplier Footprint: 0402; JLCPCB Part Class: Basic Part; Datasheet: https://atta.szlcsc.com/upload/public/pdf/source/20200306/C422600_1E6D84923E4A46A82E41ADD87F860B5C.pdf; Supplier: LCSC; Tolerance: ±1%; Temperature Coefficient: ±100ppm/℃; Type: Thick Film Resistors; Operating Temperature Range: -55℃~+155℃; Check: false
R29-R31 = 0402WGF2202TCE: Type:Thick Film Resistors Resistance:22kΩ Tolerance:±1% Tolerance:±1% Power(Watts): Overload Voltage (Max): Temperature Coefficient:±100ppm/℃ Temperature Coefficient:±100ppm/℃ Operating Temperature Range:-55℃~+155℃ Operating Temperature Range:-55℃~+155℃; LCSC Part Name: 22kΩ ±1% 62.5mW 厚膜电阻; Supplier Part: C25768; Manufacturer: UNI-ROYAL(厚声); Supplier Footprint: 0402; JLCPCB Part Class: Basic Part; Datasheet: https://atta.szlcsc.com/upload/public/pdf/source/20200306/C422600_1E6D84923E4A46A82E41ADD87F860B5C.pdf; Supplier: LCSC; Type: Thick Film Resistors; Tolerance: ±1%; Temperature Coefficient: ±100ppm/℃; Operating Temperature Range: -55℃~+155℃; Check: false
R42-R44 = 0402WGF1002TCE: Type:Thick Film Resistor Resistance:10kΩ Tolerance:±1% Tolerance:±1% Power(Watts):62.5mW Voltage-Supply(Max):50V Temperature Coefficient:±100ppm/℃ Temperature Coefficient:±100ppm/℃ Operating Temperature:-55℃~+155℃ Operating Temperature:-55℃~+155℃; LCSC Part Name: 10kΩ ±1% 62.5mW 厚膜电阻; Supplier Part: C25744; Manufacturer: UNI-ROYAL(厚声); Supplier Footprint: 0402; JLCPCB Part Class: Basic Part; Datasheet: https://item.szlcsc.com/datasheet/0402WGF1002TCE/26487.html; Supplier: LCSC; Tolerance: ±1%; Power(Watts): 62.5mW; Temperature Coefficient: ±100ppm/℃; Type: Thick Film Resistor; Operating Temperature Range: -55℃~+155℃; Voltage-Supply(Max): 50V; Operating Temperature: -55℃~+155℃; Check: false
SW3 = SLLB510100: Supplier Part: C125039; Manufacturer: ALPSALPINE(阿尔卑斯阿尔派); Supplier Footprint: SMD; JLCPCB Part Class: Extended Part; Datasheet: https://atta.szlcsc.com/upload/public/pdf/source/20170810/C125039_1502335339150879899.pdf; Supplier: LCSC; Check: false
U1 = TF-115Y-ACP9: Card Connection Mode:Push-Push Card Type:MicroSD Card (TF Card) Connector Type:Connector and Ejector Additional Card Detection Pins:Yes Supplementary Features:With Locating Post Height Above Board:- Operating Temperature:-25℃~+90℃ Operating Temperature:-2; LCSC Part Name: 自弹式 MicroSD卡(TF卡) 卡座; Supplier Part: C5454948; Manufacturer: XUNPU(讯普); Supplier Footprint: SMD; JLCPCB Part Class: Extended Part; Datasheet: https://item.szlcsc.com/datasheet/TF-115Y-ACP9/6364645.html; Supplier: LCSC; Card Connection Mode: Push-Push; Card Type: MicroSD Card (TF Card); Connector Type: Connector and Ejector; Additional Card Detection Pins: Yes; Supplementary Features: With Locating Post; Operating Temperature: -25℃~+90℃; Check: false
U5 = SD8931: Supplier Part: C48982555; Manufacturer: WAVE(兴威帆电子); Supplier Footprint: SOP-8; JLCPCB Part Class: Extended Part; Datasheet: https://item.szlcsc.com/datasheet/SD8931/51313842.html; Supplier: LCSC; Check: false
U6 = W25Q128JVSIQ: Interface Type:- Memory Size:128Mbit Clock Frequency (fc):- Supply Voltage:- Supply Voltage:- Supply Current (Read):- Supply Current (Program):- Supply Current (Erase):- Standby supply current:- Page Programming Time (Tpp):- Block Erase Time (tBE):- Data; LCSC Part Name: W25Q128JVSIQ 编带; Supplier Part: C97521; Manufacturer: WINBOND(华邦); Supplier Footprint: SOP-8-208mil; JLCPCB Part Class: Basic Part; Datasheet: https://atta.szlcsc.com/upload/public/pdf/source/20170316/1489627409956.pdf; Supplier: LCSC; Memory Size: 128Mbit; Check: false; Standardization Check: false
U7 = TLV61046ADBVR: Function:boost converterType Output Type:Adjustable Input Voltage:1.8V~5.5V Input Voltage:1.8V~5.5V Output Voltage:3.3V~28V Output Voltage:3.3V~28V Output Current (Max):- Switching Frequency:1.05MHz Operating Temperature:-40℃~+125℃@(TJ) Operating Temperat; Supplier Part: C464815; Manufacturer: TI(德州仪器); Supplier Footprint: SOT-23-6; JLCPCB Part Class: Extended Part; Datasheet: https://www.ti.com/cn/lit/gpn/tlv61046a; Supplier: LCSC; Function: boost converterType; Output Type: Adjustable; Input Voltage: 1.8V~5.5V; Output Voltage: 3.3V~28V; Switching Frequency: 1.05MHz; Operating Temperature: -40℃~+125℃@(TJ); Number of Outputs: 1; Topology: Boost; Switch tube (built-in/external): 内置; Check: false
U9 = 24C64S(XBLW): Interface Type:I2C Memory Size:64Kbit Clock Frequency (fc):1MHz Clock Frequency (fc):1MHz Supply Voltage:1.8V~5.5V Supply Voltage:1.8V~5.5V Write Cycle Time (Tw):- Data Retention - TDR (Year):- Write Cycle Endurance:- Operating Temperature:- Operating Tem; LCSC Part Name: 64Kbit 串行EEPROM; Supplier Part: C41408505; Manufacturer: XBLW(芯伯乐); Supplier Footprint: SOT-23-5; JLCPCB Part Class: Extended Part; Datasheet: https://atta.szlcsc.com/upload/public/pdf/source/20240923/A3E70BC338BD871C99DB6D87E8EE0B9D.pdf; Supplier: LCSC; Interface Type: I2C; Memory Size: 64Kbit; Clock Frequency (fc): 1MHz; Supply Voltage: 1.8V~5.5V; Check: false
U14 = 74HC14D,653: Input Type:Schmitt Trigger Supply Voltage(Single):2V~6V Supply Voltage(Single):2V~6V Supply Current (Max):2uA Number of Circuits:6 Number of Inputs:1 Sink Current:5.2mA Source Current:5.2mA High level range (VIH):1.5V~4.2V High level range (VIH):1.5V~4.2V; LCSC Part Name: 六路施密特触发反相器; Supplier Part: C5605; Manufacturer: Nexperia(安世); Supplier Footprint: SOIC-14; JLCPCB Part Class: Basic Part; Datasheet: https://atta.szlcsc.com/upload/public/pdf/source/20170209/1486607341486.pdf; Supplier: LCSC; Input Type: Schmitt Trigger; Supply Voltage(Single): 2V~6V; Supply Current (Max): 2uA; Number of Circuits: 6; Number of Inputs: 1; Sink Current: 5.2mA; Source Current: 5.2mA; High level range (VIH): 1.5V~4.2V; Low level range (VIL): 300mV~1.2V; Max Propagation Delay: 21ns@6V,50pF; Series: 74HCSeries; Operating Temperature: -40℃~+125℃; Check: false

## Nets
3.3V: C6.2 C9.2 C11.2 C13.2 C16.2 C17.2 C22.1 C23.2 C24.1 C26.2 C29.2 C31.2 C32.2 C37.2 C45.2 CN2.2 CN3.1 FPC1.9 L3.2 L5.1 LED1.2(A) R3.2 R6.2 R7.2 R8.2 R9.1 R10.2 R11.2 R12.2 R15.1 R17.1 R18.1 R20.1 R21.1 R42.2 R43.2 R44.2 SW1.3 TP6.1(TEST_PAD1) U2.4(VIN) U2.6(VIN) U5.2(VDD) U6.3(IO2) U6.7(IO3) U6.8(VCC) U7.4(EN) U8.8(VCC) U9.4(VCC) U12.1(VDD) U12.36(VDD) U12.64(VDD) U14.14(VCC) ; also on sheet 3
3.3V_ANA: C34.2 C36.2 L5.2 U12.13(VDDA)
5V: C8.2 C20.2 L4.1 TP9.1(TEST_PAD1) U4.1(EN) U4.4(VIN) U7.3(FB) U7.6(VIN) U10.1(VOUT) ; also on sheet 3
12V: C15.2 C18.2 C19.2 FPC1.2 FPC1.11 TP8.1(TEST_PAD1) U7.5(VOUT)
GND: BT1.3(-) C4.1 C5.2 C6.1 C8.1 C11.1 C13.1 C14.1 C15.1 C16.1 C17.1 C18.1 C19.1 C20.1 C21.1 C22.2 C23.1 C24.2 C25.1 C26.1 C27.1 C28.1 C29.1 C30.2 C31.1 C32.1 C33.1 C34.1 C35.1 C36.1 C37.1 C38.1 C39.2 C40.2 C41.2 C45.1 CN2.1 CN2.7 CN2.8 CN3.6 CN3.7 CN3.8 D2.2 D2.3 D2.4 D2.7 D2.8 D2.9 D3.2 D3.3 D3.8 D3.9 D4.3 D4.8 D5.2(A) D6.1(C) D7.3 D7.4 D7.5 D7.6 D7.7 D7.8 D8.1(C) D9.3 D9.8 D13.1(C) D14.1(C) D15.1(C) FPC1.1 FPC1.12 FPC1.13 FPC1.14 M2.1 M3.1 M4.1 R2.1 R4.1 R14.1 R22.2 R23.2 R24.2 R25.1 R27.1 RN2.1 RN2.8 SW2.3 SW3.4 SW3.5 SW3.6 SW3.7 SW3.C TP2.1(TEST_PAD1) U1.6(VSS) U1.10 U1.11 U1.12 U1.13 U2.2(GND) U2.5(GND) U4.2(GND) U5.5(GND) U6.4(GND) U7.2(GND) U8.4(GND) U9.2(GND) U9.5(WP) U10.2(GND) U10.5(GND) U12.12(VSSA) U12.31(VSS) U12.63(VSS) U14.7(GND) USBC1.A1(GND) USBC1.A12(GND) USBC1.B1(GND) USBC1.B12(GND) X2.2(GND) X2.4(GND) ; also on sheet 3
VBAT: BT1.1(+) BT1.2(+) C21.2 U5.6(VBAT)
VBUS: C25.2 U10.3(ON) U10.4(VIN) U10.6(VIN) U11.2
ADC_VIO: U12.11(PC3) ; also on sheet 3
AUX_RXD: U12.25(PC5) ; also on sheet 3
AUX_SWO: U12.47(PF6) ; also on sheet 3
AUX_TXD: U12.24(PC4) ; also on sheet 3
BOOT0: D6.2(A) R23.1 SW1.4 U12.60(PF11/BOOT0)
CAN_GND: M1.1 ; also on sheet 3
CAN_RX: U12.61(PB8) ; also on sheet 3
CAN_TX: R19.2 ; also on sheet 3
CONSOLE_RXD: CN3.3 D9.4 D9.7 U12.38(PC7)
CONSOLE_TXD: CN3.2 D9.5 D9.6 U12.37(PC6)
DISP_CS: FPC1.7 U12.54(PD2)
DISP_DC: FPC1.5 U12.48(PF7)
DISP_RST: FPC1.6 U12.53(PC12)
FLASH_CS: R9.2 RN3.8 U6.1(CS#)
HS_DM: D7.2 D7.9 U12.34(OTGHS1_D-) USBC1.A7(DN1) USBC1.B7(DN2)
HS_DP: D7.1 D7.10 U12.35(OTGHS1_D+) USBC1.A6(DP1) USBC1.B6(DP2)
HS_R: R24.1 U12.33(OTGHS1_R)
HS_VBUS: D5.1(K) U11.1 USBC1.A4(VBUS) USBC1.A9(VBUS) USBC1.B4(VBUS) USBC1.B9(VBUS)
I2C1_SCL: CN2.4 D4.2 D4.9 R15.2 RN1.1 RN1.8 U5.8(SCL) U9.1(SCL) U12.58(PB6)
I2C1_SDA: CN2.3 D4.1 D4.10 R17.2 U5.7(SDA) U9.3(SDA) U12.59(PB7)
I2C3_SCL: CN2.6 D4.5 D4.6 R20.2 U12.8(PC0)
I2C3_SDA: CN2.5 D4.4 D4.7 R21.2 U12.9(PC1)
IREF: FPC1.8 R14.2
IRQ_I2C: R11.1 U5.3(INT) U12.2(PC13)
IRQ_NEXT: U12.30(PB12) U14.12(6Y)
IRQ_PREV: U12.28(PB2) U14.8(4Y)
IRQ_SELECT: U12.29(PB10) U14.10(5Y)
LED0: R38.1 U12.10(PC2)
OSC32_IN: C28.2 U12.3(PC14) X1.1
OSC32_OUT: C27.2 U12.4(PC15) X1.2
OSC_IN: C30.1 U12.5(PF0) X2.3
OSC_OUT: C33.2 U12.6(PF1) X2.1
PA0: U12.14(PA0) ; also on sheet 3
PA1: U12.15(PA1) ; also on sheet 3
PA4: U12.20(PA4) ; also on sheet 3
PA5: U12.21(PA5) ; also on sheet 3
PA6: U12.22(PA6) ; also on sheet 3
PA7: U12.23(PA7) ; also on sheet 3
PB1: U12.27(PB1) ; also on sheet 3
QSPI1_CS: R18.2 RN2.5 U8.1(CS#)
QSPI1_IO0: RN1.2 U8.5(DI)
QSPI1_IO1: RN2.6 U8.2(DO)
QSPI1_IO2: RN2.7 U8.3(IO2)
QSPI1_IO3: RN1.4 U8.7(IO3)
QSPI1_SCK: RN1.3 U8.6(CLK)
QSPI_CS: RN2.4 U12.52(PC11)
QSPI_IO0: RN1.7 U12.57(PB5)
QSPI_IO1: RN2.3 U12.51(PC10)
QSPI_IO2: RN2.2 U12.50(PA15)
QSPI_IO3: RN1.5 U12.55(PB3)
QSPI_SCK: RN1.6 U12.56(PB4)
RST: C35.2 D8.2(A) SW2.4 U12.7(NRST)
RTC: R12.1 TP7.1(TEST_PAD1) U5.1(FREQ)
SD_CS: D2.1 D2.10 R6.1 RN3.5 U1.2(CD/DAT3)
SD_DETECT: D3.5 D3.6 R3.1 U1.Cd U12.40(PC9)
SD_ON: R2.2 U2.3(ON) U12.39(PC8)
SERIAL_RXD: U12.17(PA3) ; also on sheet 3
SERIAL_TXD: U12.16(PA2) ; also on sheet 3
SPI2_CLK: D3.1 D3.10 FPC1.4 RN3.7 U1.5(CLX) U6.6(CLK)
SPI2_MISO: D3.4 D3.7 R1.1 R8.1 R13.1 U12.45(PA12)
SPI2_MOSI: D2.5 D2.6 FPC1.3 R7.1 RN3.6 U1.3(CMD) U6.5(DI)
SW_NEXT: D13.2(A) R42.1 SW3.2 U14.1(1A)
SW_PREV: D15.2(A) R44.1 SW3.1 U14.5(3A)
SW_SELECT: D14.2(A) R43.1 SW3.T U14.3(2A)
SYS_SWCLK: CN3.5 D9.1 D9.10 U12.49(PA14)
SYS_SWDIO: CN3.4 D9.2 D9.9 U12.46(PA13)
T_OE: U12.18(PF4) ; also on sheet 3
T_POWER_ON: U12.19(PF5) ; also on sheet 3
T_RST_IN: U12.26(PB0) ; also on sheet 3
T_RST_OUT: U12.32(PB13) ; also on sheet 3
VCOMH: C14.2 FPC1.10
VFB: C9.1 R4.2 R10.1 U4.5(FB)
VSD: C4.2 C5.1 TP5.1(TEST_PAD1) U1.4(VDD) U2.1(VOUT)
VSW: L3.1 U4.3(SW)
$1N200169: RN3.4 U12.44(PA11)
$1N200184: R19.1 U12.62(PB9)
$1N200200: RN3.3 U12.43(PA10)
$1N200201: RN3.2 U12.42(PA9)
$1N200203: RN3.1 U12.41(PA8)
$1N206167: LED1.1(K) R38.2
$1N254528: R22.1 USBC1.B5(CC2)
$1N254529: R25.2 USBC1.A5(CC1)
$1N254540: C38.2 R27.2 USBC1.0(SH)
$2N508660: R1.2 U1.7(DAT0)
$2N576115: L4.2 U7.1(SW)
$2N741099: R13.2 U6.2(DO)
$2N788708: C39.1 R29.2 U14.13(6A)
$2N788718: R29.1 U14.2(1Y)
$2N788818: C40.1 R30.2 U14.11(5A)
$2N788825: R30.1 U14.4(2Y)
$2N788929: R31.1 U14.6(3Y)
$2N788938: C41.1 R31.2 U14.9(4A)

Not connected (* = marked no-connect by the designer): SW1 1* 2*; SW2 1* 2*; U1 1(DAT2)* 8(DAT1)*; U5 4(NC)*; USBC1 1(SH)* 2(SH)* 3(SH)* A8(SBU1)* B8(SBU2)*

## Notes on the sheets
sheet 1
- C125113 LTST-S270KGKT SIDE
  (C2286 KT-0603R BASIC)
- 12MHZ 12PF
- 32768HZ 12.5PF
- SWD HEADER
- 1%
- INRUSH CURRENT LIMIT
- C165948 TYPE-C-31-M-12 (Korean Hroparts Elec)
  C3020560 USB4105-GF-A (GCT)
  C3197731 CU3216SASDLR010-NH (CVILUX)
- 25V
- C19674180 PRE-ORDER
  C9900094935 CONSIGNED PART
- CPU
- USB
- PCB ASSEMBLY:
  PCB CONTROLLED IMPEDANCE JLC04161H-7628
  NO SOLDER PASTE ON MIDDLE PAD OF BATTERY HOLDER C964818
  ORDER NUMBER ON PCB: SPECIFY POSITION
  3D PRINTING:
  3D SHELL COMPONENT SIDE SLA RESIN 9600 WHITE
  3D SHELL DISPLAY SIDE SLA RESIN 8100 TRANSPARENT
  3D SHELL CLOSES WITH 4 NYLON M3 10MM SCREWS AND NUTS
  CHECKLIST:
  NO SILKSCREEN IN CANBUS ISOLATION BARRIER
  DS3231 RTC INTERRUPT ON MCU EXTI PIN
  TARGET T_SWO/TRACESWO ON USART RX
  SD CARD LENGTH, IMPEDANCE
  USB LENGTH, IMPEDANCE
  USB 10 MIL TRACE 8 MIL SPACE
  50 OHM 13 MIL TRACE
  TRANSMISSION LINES OVER GROUND PLANE
- CR1220
  BUTTON BATTERY
- QUAD SPI FLASH
- SWITCHING POWER SUPPLY WITH SOFT START
  C479074 SY8089A1AAC
  C141836 TLV62569DBVR
  C5116078 TMI3408C
- POWER
sheet 2
- C41408505 24C64S(XBLW)
  C5263778 FT24C64A-ELR-T
  I2C EEPROM, 32 OR 64 KBIT, 3.3V, SOT-23-5
- RTC, I2C, BUILT-IN CRYSTAL, TEMPERATURE COMPENSATED
  C48982555 SD8931
  C107410 DS3231MZ+TRL
- REAL-TIME CLOCK
- EEPROM
- I2C CONNECTOR
- C125039 ALPS SLLB510100
  C561480 TM-2024A
  C145907 K1-1511SA-01
- C5454948 TF-115Y-ACP9
  SDCARD CONNECTOR, GOLD-PLATED
- MICRO SD CARD
- I_SAT ≥ 1.2A
  DCR ≤ 200 mΩ
- OLED 12V
  C464815 TLV61046ADBVR
  C42371112 SGM6604YN6G/TR
- C25800 0402 910k 1%
  C11866 0402 910k 5%
- 20MS DEBOUNCE
- DISPLAY
- MULTI-DIRECTIONAL SWITCH
- SPI FLASH
